# EAGLE design m1-data-register-a (EAGLE 9.6.1)
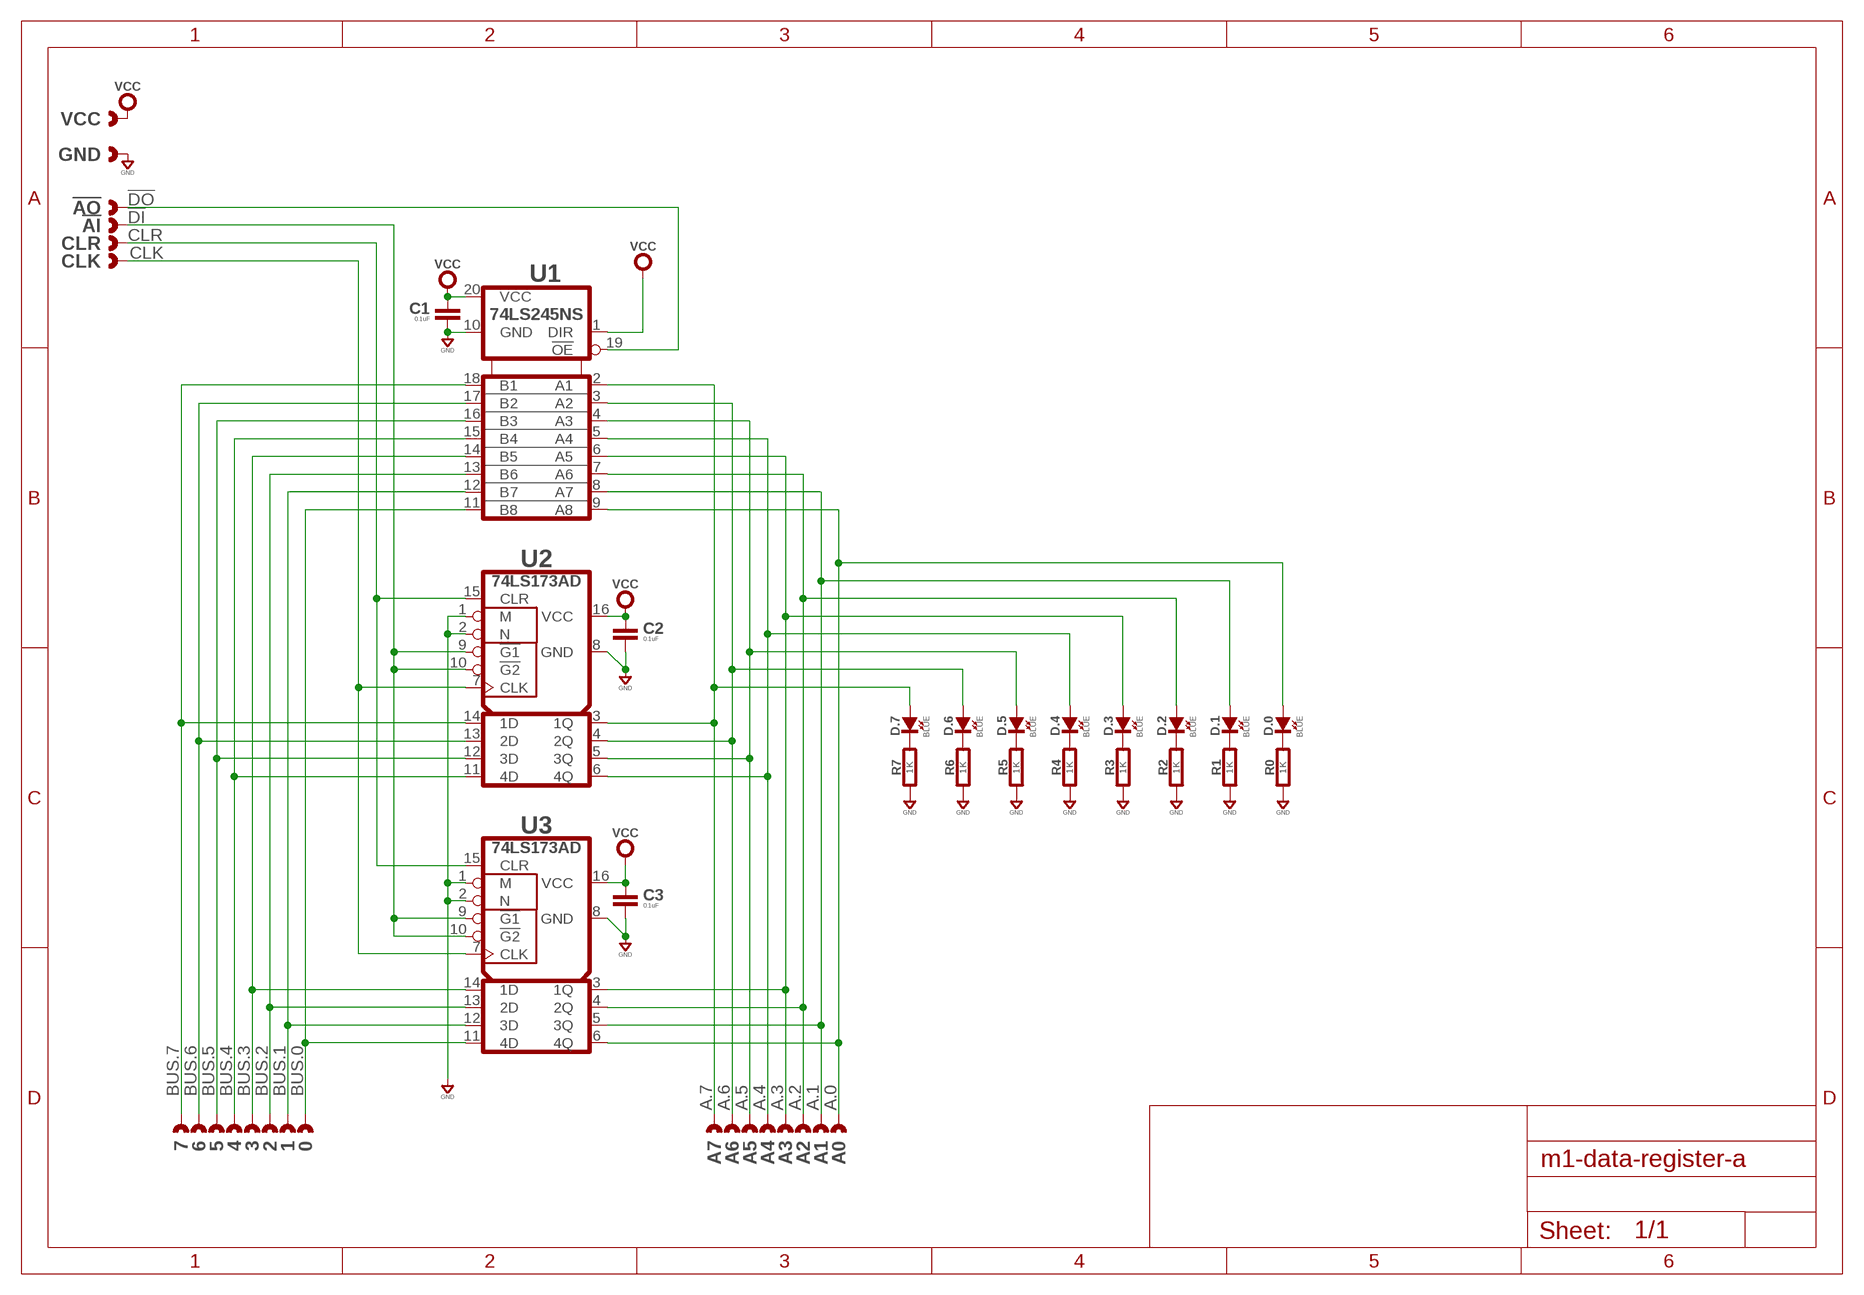
[diagram p0: schematic, sheet 1]

## Parts
0  CAST-01X1  [CAST01-2.54MM]
1  CAST-01X1  [CAST01-2.54MM]
2  CAST-01X1  [CAST01-2.54MM]
3  CAST-01X1  [CAST01-2.54MM]
4  CAST-01X1  [CAST01-2.54MM]
5  CAST-01X1  [CAST01-2.54MM]
6  CAST-01X1  [CAST01-2.54MM]
7  CAST-01X1  [CAST01-2.54MM]
!AI  CAST-01X1  [CAST01-2.54MM]
!AO  CAST-01X1  [CAST01-2.54MM]
A0  CAST-01X1  [CAST01-2.54MM]
A1  CAST-01X1  [CAST01-2.54MM]
A2  CAST-01X1  [CAST01-2.54MM]
A3  CAST-01X1  [CAST01-2.54MM]
A4  CAST-01X1  [CAST01-2.54MM]
A5  CAST-01X1  [CAST01-2.54MM]
A6  CAST-01X1  [CAST01-2.54MM]
A7  CAST-01X1  [CAST01-2.54MM]
C1  0.1uF  CAPACITOR0603  [0603-CAP]
C2  0.1uF  CAPACITOR0603  [0603-CAP]
C3  0.1uF  CAPACITOR0603  [0603-CAP]
CLK  CAST-01X1  [CAST01-2.54MM]
CLR  CAST-01X1  [CAST01-2.54MM]
D.0  BLUE  SMT0603  [SMD_0603]
D.1  BLUE  SMT0603  [SMD_0603]
D.2  BLUE  SMT0603  [SMD_0603]
D.3  BLUE  SMT0603  [SMD_0603]
D.4  BLUE  SMT0603  [SMD_0603]
D.5  BLUE  SMT0603  [SMD_0603]
D.6  BLUE  SMT0603  [SMD_0603]
D.7  BLUE  SMT0603  [SMD_0603]
GND  CAST-01X1  [CAST01-2.54MM]
R0  1K  RESISTOR0603  [0603-RES]
R1  1K  RESISTOR0603  [0603-RES]
R2  1K  RESISTOR0603  [0603-RES]
R3  1K  RESISTOR0603  [0603-RES]
R4  1K  RESISTOR0603  [0603-RES]
R5  1K  RESISTOR0603  [0603-RES]
R6  1K  RESISTOR0603  [0603-RES]
R7  1K  RESISTOR0603  [0603-RES]
U1  74LS245NS  [SO20]
U2  74LS173AD  [SO16]
U3  74LS173AD  [SO16]
VCC  CAST-01X1  [CAST01-2.54MM]

## Nets
!DI: !AI.1 U2.9(!G1) U2.10(!G2) U3.9(!G1) U3.10(!G2)
!DO: !AO.1 U1.19(!OE)
A.0: A0.1 D.0.A U1.9(A8) U3.6(4Q)
A.1: A1.1 D.1.A U1.8(A7) U3.5(3Q)
A.2: A2.1 D.2.A U1.7(A6) U3.4(2Q)
A.3: A3.1 D.3.A U1.6(A5) U3.3(1Q)
A.4: A4.1 D.4.A U1.5(A4) U2.6(4Q)
A.5: A5.1 D.5.A U1.4(A3) U2.5(3Q)
A.6: A6.1 D.6.A U1.3(A2) U2.4(2Q)
A.7: A7.1 D.7.A U1.2(A1) U2.3(1Q)
BUS.0: 0.1 U1.11(B8) U3.11(4D)
BUS.1: 1.1 U1.12(B7) U3.12(3D)
BUS.2: 2.1 U1.13(B6) U3.13(2D)
BUS.3: 3.1 U1.14(B5) U3.14(1D)
BUS.4: 4.1 U1.15(B4) U2.11(4D)
BUS.5: 5.1 U1.16(B3) U2.12(3D)
BUS.6: 6.1 U1.17(B2) U2.13(2D)
BUS.7: 7.1 U1.18(B1) U2.14(1D)
CLK: CLK.1 U2.7(CLK) U3.7(CLK)
CLR: CLR.1 U2.15(CLR) U3.15(CLR)
GND: C1.2 C2.2 C3.2 GND.1 R0.1 R1.1 R2.1 R3.1 R4.1 R5.1 R6.1 R7.1 U1.10(GND) U2.1(M) U2.2(N) U2.8(GND) U3.1(M) U3.2(N) U3.8(GND)
N$1: D.0.K(C) R0.2
N$2: D.1.K(C) R1.2
N$3: D.2.K(C) R2.2
N$4: D.3.K(C) R3.2
N$5: D.4.K(C) R4.2
N$6: D.5.K(C) R5.2
N$7: D.6.K(C) R6.2
N$8: D.7.K(C) R7.2
VCC: C1.1 C2.1 C3.1 U1.1(DIR) U1.20(VCC) U2.16(VCC) U3.16(VCC) VCC.1

## Library data of the parts
0 1-7 !AI !AO A0 A1-A7 CLK CLR GND VCC = con-headers:CAST-01X1: Castelated Edge Hole Pad
C1-C3 = rlc:CAPACITOR: Capacitor CAP
D.0 D.1-D.7 = led:SMT: LED SMT
R0 R1-R7 = rlc:RESISTOR: Resistor
U1 = logic:74*245?: 74245 Octal Transceiver
U2 U3 = logic:74*173A?: 74*173 Logic

## Board
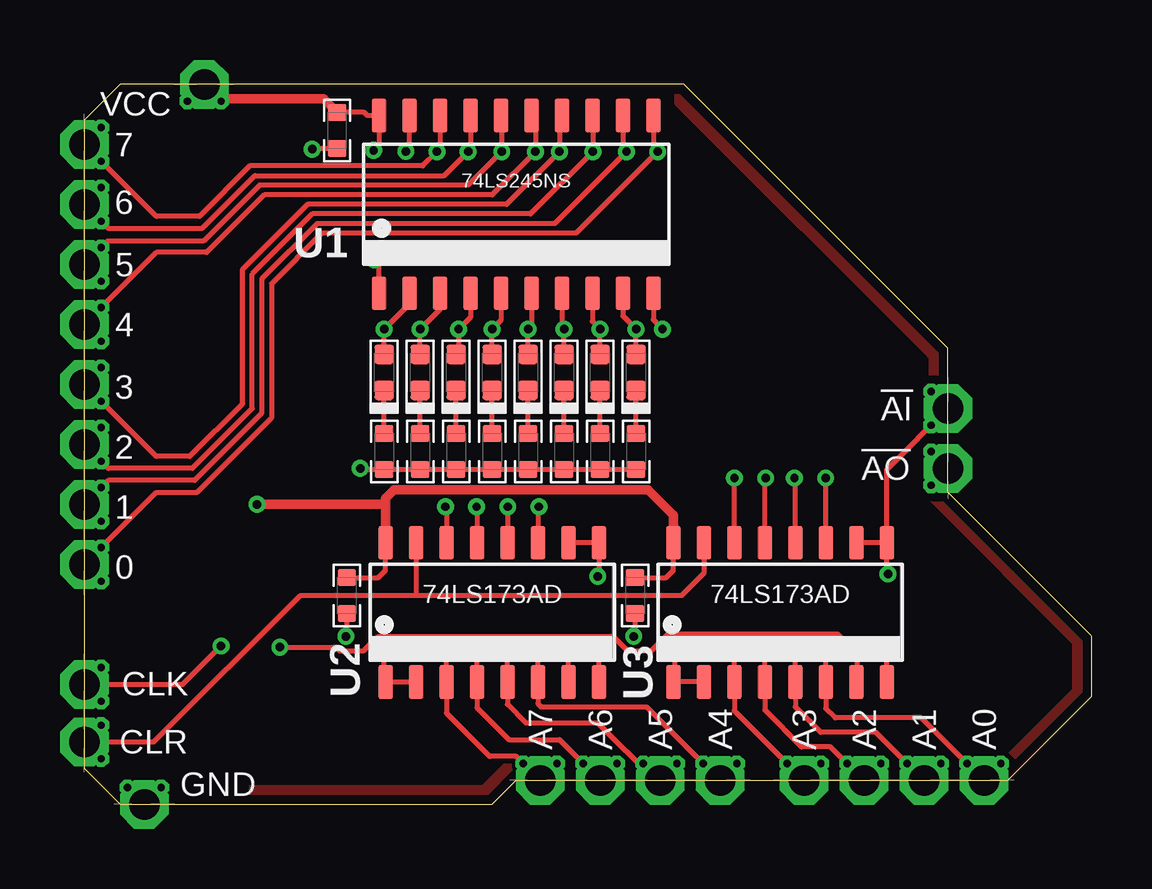
[diagram p1: board, top side]
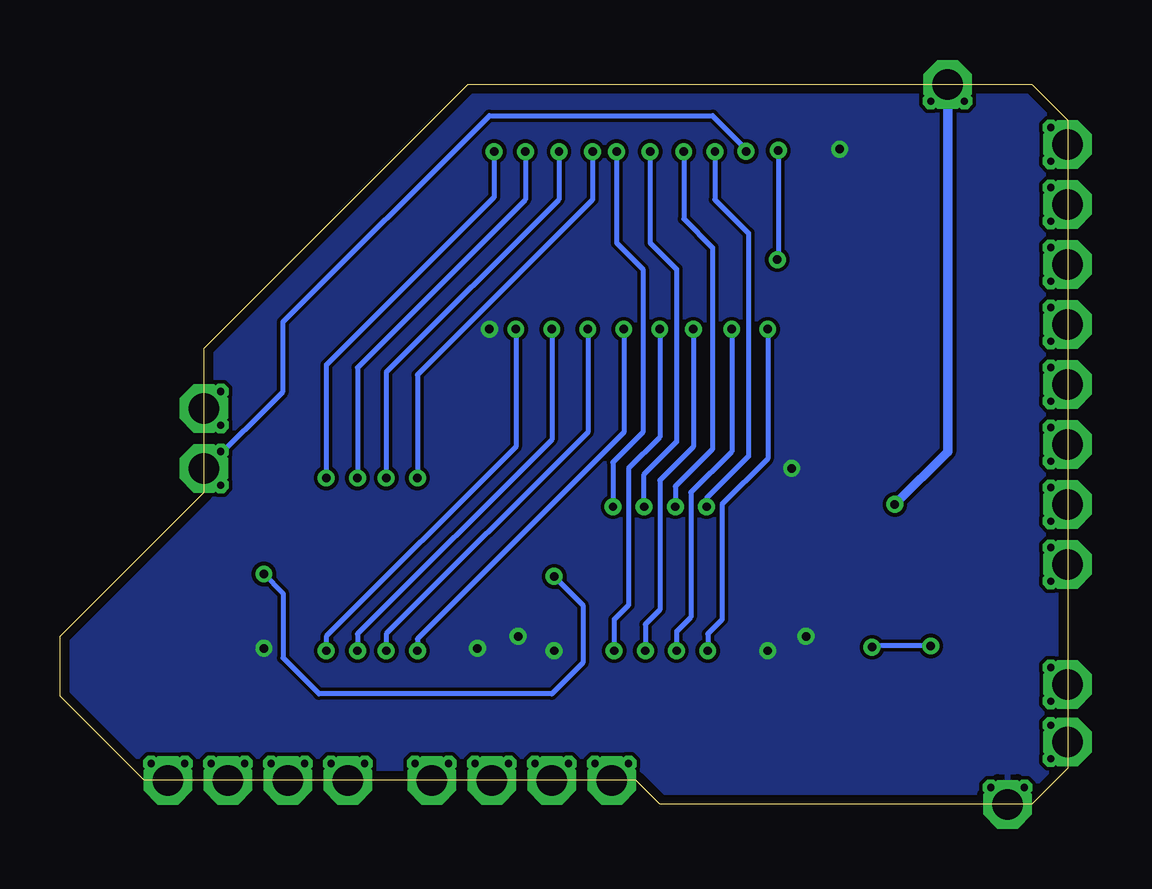
[diagram p2: board, bottom side, seen from below]

Size 42 x 30 mm. Coordinates in mm from the lower left corner, seen from the top.
Outline: 0,1.5 1.5,0 17,0 18,1 38.5,1 42,4.5 42,7 36,13 36,19 25,30 1.5,30 0,28.5 0,1.5
Copper layers (1*16): Top 0.0356mm / dielectric 1.5011mm / Bottom 0.0356mm
Design rules "OSH-CircuitMonkey *": minimum track width 6mil, minimum drill 12mil, track to track 6mil, track to pad 6mil, pad to pad 6mil, via to via 6mil, smd to smd 6mil, copper to edge 15mil, drill to drill 6mil, minimum pad ring 7mil, minimum via ring 7mil, stop-mask expansion 3mil, vias tented up to drill 14mil, thermal gap 10mil

### Footprints (pad centres in the part's own frame; a part is rotated, then mirrored left to right if it is on the bottom)
CAST01-2.54MM = drill 1.27 pad 2.032 octagon: 1 0,0 | drill 0.305 octagon: P$1 -0.7,0.7; P$2 -0.7,-0.7
0603-CAP = smd 0.711 x 0.762: 1 -0.752,0; 2 0.752,0
SMD_0603 = smd 0.8 x 0.8: A 0.75,0; K -0.75,0
0603-RES = smd 0.711 x 0.762: 1 -0.752,0; 2 0.752,0
SO20 = smd 0.6 x 1.4: 1 -5.715,-3.7; 2 -4.445,-3.7; 3 -3.175,-3.7; 4 -1.905,-3.7; 5 -0.635,-3.7; 6 0.635,-3.7; 7 1.905,-3.7; 8 3.175,-3.7; 9 4.445,-3.7; 10 5.715,-3.7; 11 5.715,3.7; 12 4.445,3.7; 13 3.175,3.7; 14 1.905,3.7; 15 0.635,3.7; 16 -0.635,3.7; 17 -1.905,3.7; 18 -3.175,3.7; 19 -4.445,3.7; 20 -5.715,3.7
SO16 = smd 0.6 x 1.4: 1 -4.445,-2.9; 2 -3.175,-2.9; 3 -1.905,-2.9; 4 -0.635,-2.9; 5 0.635,-2.9; 6 1.905,-2.9; 7 3.175,-2.9; 8 4.445,-2.9; 9 4.445,2.9; 10 3.175,2.9; 11 1.905,2.9; 12 0.635,2.9; 13 -0.635,2.9; 14 -1.905,2.9; 15 -3.175,2.9; 16 -4.445,2.9

### Placement (x,y rotation side)
0  0,10 180 top
1  0,12.5 180 top
2  0,15 180 top
3  0,17.5 180 top
4  0,20 180 top
5  0,22.5 180 top
6  0,25 180 top
7  0,27.5 180 top
!AI  36,16.5 0 top
!AO  36,14 0 top
A0  37.5,1 270 top
A1  35,1 270 top
A2  32.5,1 270 top
A3  30,1 270 top
A4  26.5,1 270 top
A5  24,1 270 top
A6  21.5,1 270 top
A7  19,1 270 top
C1  10.54,28.08 270 top
C2  10.94,8.7 270 top
C3  22.96,8.7 270 top
CLK  0,5 180 top
CLR  0,2.6 180 top
D.0  23,18 90 top
D.1  21.5,18 90 top
D.2  20,18 90 top
D.3  18.5,18 90 top
D.4  17,18 90 top
D.5  15.5,18 90 top
D.6  14,18 90 top
D.7  12.5,18 90 top
GND  2.5,0 270 top
R0  23,14.7 90 top
R1  21.5,14.7 90 top
R2  20,14.7 90 top
R3  18.5,14.7 90 top
R4  17,14.7 90 top
R5  15.5,14.7 90 top
R6  14,14.7 90 top
R7  12.5,14.7 90 top
U1  18,25 0 top
U2  17,8 0 top
U3  29,8 0 top
VCC  5,30 90 top

### Tracks (layer width: path | path; a pad name or v marks a point on that pad's centre or on a via)
!DI  (via drill 0.35)
  Top 0.2: U3.9 33.45,13.95 !AI.1 | v33.5,9.6 33.45,9.65 U3.9 | U3.9 U3.10 | U2.10 U2.9 21.45,9.54 v21.4,9.5
  Bottom 0.2: v33.5,9.6 32.7,8.8 32.7,6.1 31.2,4.6 21.5,4.6 20.2,5.9 20.2,8.3 v21.4,9.5
!DO  (via drill 0.35)
  Top 0.2: v13.4,27.2 13.4,27.25 13.55,27.4 U1.19
  Bottom 0.2: !AO.1 35.9,14 32.7,17.2 32.7,20.1 24.1,28.7 14.8,28.7 13.4,27.3 v13.4,27.2
A.0  (via drill 0.35)
  Top 0.2: A0.1 34.9,3.6 31.3,3.6 30.91,4 U3.6 v30.91,6.39 v30.9,6.4 | U1.9 22.45,20.36 22.95,19.85 v23,19.8 D.0.A
  Bottom 0.2: v23,19.8 23,14.9 30.9,7 v30.9,6.4
A.1  (via drill 0.35)
  Top 0.2: A1.1 33,3 30.7,3 29.64,4.07 U3.5 29.64,6.37 v29.6,6.4 | U1.8 21.18,20.12 v21.5,19.8 D.1.A
  Bottom 0.2: v21.5,19.8 21.5,15.2 29.6,7.1 v29.6,6.4
A.2  (via drill 0.35)
  Top 0.2: A2.1 31.1,2.4 29.9,2.4 28.36,3.94 U3.4 28.36,6.37 v28.4,6.4 | U1.7 19.91,19.89 v20,19.8 D.2.A
  Bottom 0.2: v20,19.8 20,15.5 28.4,7.1 v28.4,6.4
A.3  (via drill 0.35)
  Top 0.2: A3.1 27.09,3.9 U3.3 v27.09,6.39 v27.1,6.4 | U1.6 18.64,19.93 v18.5,19.8 D.3.A
  Bottom 0.2: v18.5,19.8 18.5,15.5 27.1,6.9 v27.1,6.4
A.4  (via drill 0.35)
  Top 0.2: A4.1 23.45,4.05 19.05,4.05 18.91,4.2 U2.6 v18.91,6.39 v18.9,6.4 | U1.5 17.36,20.16 v17,19.8 D.4.A
  Bottom 0.2: v18.9,6.4 18.9,7.7 18.3,8.3 18.3,14 17,15.3 v17,19.8
A.5  (via drill 0.35)
  Top 0.2: A5.1 23.8,1 21.4,3.4 18.4,3.4 17.64,4.17 U2.5 17.64,6.37 v17.6,6.4 | U1.4 16.09,20.3 v15.6,19.8 15.6,18.85 D.5.A
  Bottom 0.2: v17.6,6.4 17.6,7.5 17,8.1 17,13.5 15.6,14.9 v15.6,19.8
A.6  (via drill 0.35)
  Top 0.2: A6.1 19.8,2.7 17.7,2.7 16.36,4.04 U2.4 16.36,6.33 v16.3,6.4 | U1.3 14.82,20.62 v14,19.8 D.6.A
  Bottom 0.2: v16.3,6.4 16.3,7.2 15.7,7.8 15.7,13 14,14.7 v14,19.8
A.7  (via drill 0.35)
  Top 0.2: A7.1 18,2 16.9,2 15.1,3.81 U2.3 15.1,6.3 v15,6.4 | U1.2 13.55,20.86 v12.5,19.8 D.7.A
  Bottom 0.2: v15,6.4 15,7.1 14.4,7.7 14.4,12.5 12.5,14.4 v12.5,19.8
BUS.0  (via drill 0.35)
  Top 0.2: U1.11 23.71,27.39 v23.9,27.2 20.5,23.8 9.9,23.8 7.8,21.7 7.8,16.1 4.7,13 3,13 0.1 | U3.11 v30.91,13.6 v30.9,13.6
  Bottom 0.2: v23.9,27.2 23.9,25.3 30.9,18.3 v30.9,13.6
BUS.1  (via drill 0.35)
  Top 0.2: U1.12 22.45,27.36 v22.6,27.2 19.6,24.2 9.7,24.2 7.4,21.9 7.4,16.3 4.6,13.5 1,13.5 1.1 | U3.12 29.64,13.56 v29.6,13.6
  Bottom 0.2: v22.6,27.2 22.6,25.2 29.6,18.2 v29.6,13.6
BUS.2  (via drill 0.35)
  Top 0.2: U1.13 21.2,28.68 v21.2,27.2 18.6,24.6 9.5,24.6 7,22.1 7,16.5 4.5,14 1,14 2.1 | U3.13 28.36,13.56 v28.4,13.6
  Bottom 0.2: v21.2,27.2 21.2,25.2 28.4,18 v28.4,13.6
BUS.3  (via drill 0.35)
  Top 0.2: U1.14 20,28.6 19.84,28.6 19.8,28.56 v19.8,27.2 17.6,25 9.3,25 6.6,22.3 6.6,16.7 4.4,14.5 3,14.5 3.1 | U3.14 v27.09,13.6 v27.1,13.6
  Bottom 0.2: v19.8,27.2 19.8,25.2 27.1,17.9 v27.1,13.6
BUS.4  (via drill 0.35)
  Top 0.2: 0.2,20 4.1 3,23 5.1,23 7.5,25.4 17,25.4 v18.8,27.2 18.8,28.54 U1.15 | v18.95,12.4 18.91,12.36 U2.11
  Bottom 0.2: v18.8,27.2 18.8,23.4 17.7,22.3 17.7,15.5 18.95,14.25 v18.95,12.4
BUS.5  (via drill 0.35)
  Top 0.2: U1.16 17.4,28.66 v17.4,27.2 16,25.8 7.3,25.8 4.97,23.47 0.97,23.47 5.1 | v17.65,12.4 17.64,12.38 U2.12
  Bottom 0.2: v17.65,12.4 17.65,13.75 16.3,15.1 16.3,22.3 17.4,23.4 v17.4,27.2
BUS.6  (via drill 0.35)
  Top 0.2: U1.17 16.09,27.3 v16,27.2 15,26.2 7.1,26.2 4.9,24 1,24 6.1 | v16.35,12.4 16.36,12.38 U2.13
  Bottom 0.2: v16,27.2 16,24.4 14.8,23.2 14.8,14.8 16.35,13.25 v16.35,12.4
BUS.7  (via drill 0.35)
  Top 0.2: U1.18 14.82,27.32 v14.7,27.2 14.1,26.6 6.9,26.6 4.8,24.5 3,24.5 7.1 | v15.05,12.4 15.1,12.36 U2.14
  Bottom 0.2: v14.7,27.2 14.7,25.2 13.3,23.8 13.3,14.5 15.05,12.75 v15.05,12.4
CCC
  pour Top: 24.6,29.6 24.6,29.2 35.2,18.6 35.2,17.9 35.6,17.9 35.6,18.8 24.8,29.6
CLK  (via drill 0.35)
  Top 0.2: CLK.1 4.1,5 v5.7,6.6 | v8.15,6.55 10.49,6.55 10.65,6.39 11.64,6.39 12.25,7 20.1,7 | 20.1,7 22.04,7 22.65,6.39 23.64,6.39 24.35,7.11 31.39,7.11 32.2,6.3 32.2,5.12 U3.7 | U2.7 20.18,6.93 20.1,7
  Bottom 0.2: v5.7,6.6 8,6.6 8.1,6.5 v8.15,6.55
CLR
  Top 0.2: U3.15 25.82,9.62 24.9,8.7 13.8,8.7 | 13.8,8.7 9,8.7 2.9,2.6 CLR.1 | U2.15 13.82,8.72 13.8,8.7
DDD
  pour Top: 35.3,12.6 35.8,12.6 41.6,6.8 41.6,4.7 38.8,1.9 38.55,2.15 41.2,4.8 41.2,6.7
EEE
  pour Top: 6.9,0.4 6.9,0.8 16.6,0.8 17.5,1.7 17.8,1.7 17.8,1.4 16.8,0.4
GND  (via drill 0.35)
  Top 0.2: U1.10 23.71,20.2 24.1,19.82 v24.1,19.8 | C1.2 9.53,27.33 v9.5,27.3 | C2.2 10.94,7.04 v10.9,7 | U3.8 33.45,6.45 v33.5,6.5 | U2.8 21.45,6.36 v21.4,6.4 | R0.1 R1.1 R2.1 R3.1 R4.1 R5.1 R6.1 R7.1 11.55,13.95 v11.5,14 | v12.5,6.4 12.5,5.16 U2.1 U2.2 | v24.6,6.5 24.6,5.14 U3.1 U3.2 | C3.2 22.96,7.06 v22.9,7
  pour Bottom: 1.5,0 0,1.5 0,28.5 1.5,30 25,30 36,19 36,13 42,7 42,4.5 38.5,1 18,1 17,0
N$1
  Top 0.2: R0.2 D.0.K
N$2
  Top 0.2: R1.2 D.1.K
N$3
  Top 0.2: R2.2 D.2.K
N$4
  Top 0.2: R3.2 D.3.K
N$5
  Top 0.2: R4.2 D.4.K
N$6
  Top 0.2: R5.2 D.5.K
N$7
  Top 0.2: R6.2 D.6.K
N$8
  Top 0.2: R7.2 D.7.K
VCC  (via drill 0.35)
  Top 0.2: C3.1 24.25,9.45 24.55,9.76 U3.16 | C2.1 12.25,9.45 12.55,9.76 U2.16 | C1.1 11.67,28.83 11.8,28.7 U1.20 12.29,27.48 v12.06,27.25 | v12.1,22.7 12.1,22.68 12.29,22.5 U1.1
  Top 0.4: VCC.1 5.6,29.4 9.97,29.4 C1.1 | U2.16 12.55,12.4 | 12.55,12.4 12.55,12.76 12.9,13.11 23.5,13.11 24.55,12.04 U3.16 | v7.2,12.5 12.46,12.5 12.55,12.4
  Bottom 0.2: v12.1,22.7 12.06,22.74 v12.06,27.25
  Bottom 0.4: VCC.1 5,14.7 v7.2,12.5

### Text on the board
Reference: Vcc | 7 | 6 | 5 | 4 | 3 | !AI | 2 | !AO | 1 | 0 | CLK | CLR | A.7 | A.6 | A.5 | A.4 | A.3 | A.2 | A.1 | A.0 | GND